# Altium project BARBAROV Power Distrubution Board.PrjPcb
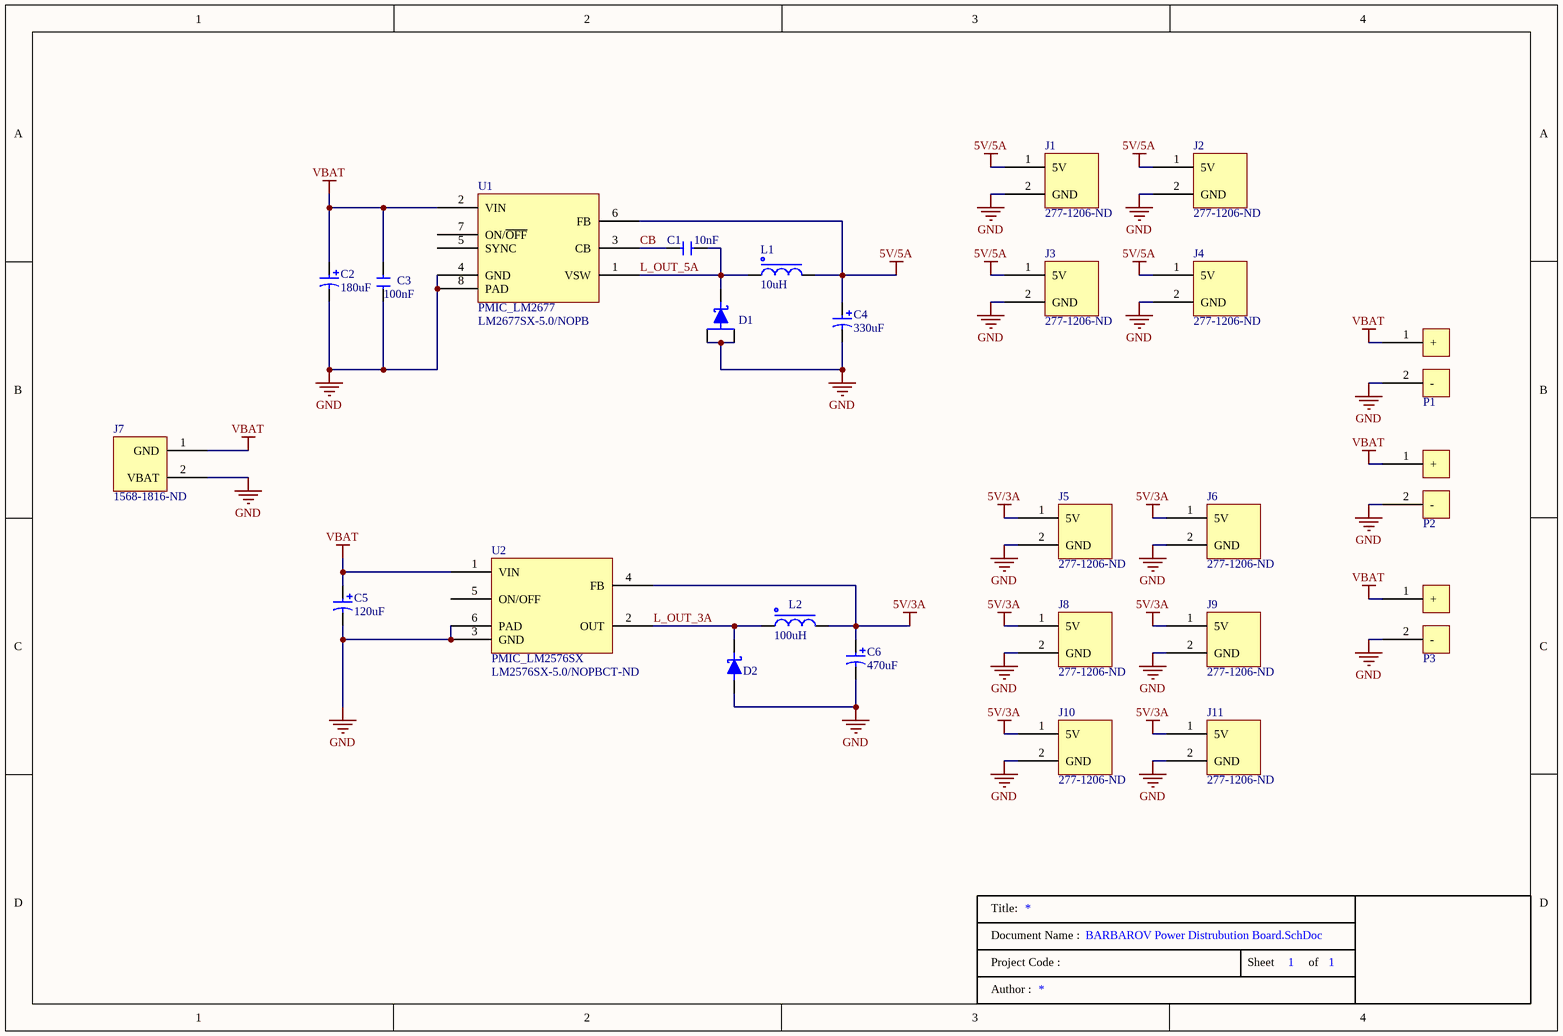
[diagram p0: BARBAROV Power Distrubution Board.SchDoc]
1 sheet, 26 parts. Net scope: global (net labels, ports and power ports of the same name join across sheets).
Board file: BARBAROV Power Distrubution Board PCB.PcbDoc

## Sheet BARBAROV Power Distrubution Board.SchDoc
size A4; SheetNumber: 1; SheetTotal: 1

### Parts
C1  Capacitance: 10nF  [0805_CAP]  (hidden comment: CAP_10nF_%10_50V_0805_X7R_CER)
C2  Capacitance: 180uF  [RADIAL-2_8.30MMX8.30MM_PANASONIC]  (hidden comment: CAP_180uF_20%_25V_SMD_ALUM POLY_8.30mmx8.30mm)
C3  Capacitance: 100nF  [0805_CAP]  (hidden comment: CAP_100nF_50V_0805_C0G_CER)
C4  Capacitance: 330uF  [RADIAL-2_8.30MMX8.30MM_PANASONIC]  (hidden comment: CAP_330uF_20%_16V_SMD_ALUM POLY_8.30mm x 8.30mm)
C5  Capacitance: 120uF  [CAP_6SVPC330M]  (hidden comment: CAP_120uF_20%_20V_ALUM POLY_SMD)
C6  Capacitance: 470uF  [CAP_EEVTG1C471Q]  (hidden comment: CAP_470uF_20%_16V_SMD_ALUM)
D1  DIODE_SCHOTTKY_200V_10A_DPAK  [3PIN_DPAK_DIODE]  (value not drawn)
D2  DIODE_SCHOTTKY_20V_4A_DO214AB  [DIOM6959X25M]  (value not drawn)
J1  Supplier Part Number 1: 277-1206-ND  [CONN TERM BLOCK HDR 2POS 90DEG 3.81MM]  (hidden comment: CONN_TERM BLOCK_HDR_2POS_VERT_3.81MM)
J2  Supplier Part Number 1: 277-1206-ND  [CONN TERM BLOCK HDR 2POS 90DEG 3.81MM]  (hidden comment: CONN_TERM BLOCK_HDR_2POS_VERT_3.81MM)
J3  Supplier Part Number 1: 277-1206-ND  [CONN TERM BLOCK HDR 2POS 90DEG 3.81MM]  (hidden comment: CONN_TERM BLOCK_HDR_2POS_VERT_3.81MM)
J4  Supplier Part Number 1: 277-1206-ND  [CONN TERM BLOCK HDR 2POS 90DEG 3.81MM]  (hidden comment: CONN_TERM BLOCK_HDR_2POS_VERT_3.81MM)
J5  Supplier Part Number 1: 277-1206-ND  [CONN TERM BLOCK HDR 2POS 90DEG 3.81MM]  (hidden comment: CONN_TERM BLOCK_HDR_2POS_VERT_3.81MM)
J6  Supplier Part Number 1: 277-1206-ND  [CONN TERM BLOCK HDR 2POS 90DEG 3.81MM]  (hidden comment: CONN_TERM BLOCK_HDR_2POS_VERT_3.81MM)
J7  Supplier Part Number 1: 1568-1816-ND  [XT60_CONN]  (hidden comment: CONN_XT60)
J8  Supplier Part Number 1: 277-1206-ND  [CONN TERM BLOCK HDR 2POS 90DEG 3.81MM]  (hidden comment: CONN_TERM BLOCK_HDR_2POS_VERT_3.81MM)
J9  Supplier Part Number 1: 277-1206-ND  [CONN TERM BLOCK HDR 2POS 90DEG 3.81MM]  (hidden comment: CONN_TERM BLOCK_HDR_2POS_VERT_3.81MM)
J10  Supplier Part Number 1: 277-1206-ND  [CONN TERM BLOCK HDR 2POS 90DEG 3.81MM]  (hidden comment: CONN_TERM BLOCK_HDR_2POS_VERT_3.81MM)
J11  Supplier Part Number 1: 277-1206-ND  [CONN TERM BLOCK HDR 2POS 90DEG 3.81MM]  (hidden comment: CONN_TERM BLOCK_HDR_2POS_VERT_3.81MM)
L1  Inductance: 10uH  [IND13.70MM13.70MMX7MM]  (hidden comment: IND_10uH_10A_16.8MOHM_SMD)
L2  Inductance: 100uH  [SMD_IND_22.48MMX22.00MM]  (hidden comment: IND_100uH_9.1A_39.4MOHM_SM)
P1  ESC_PAD  [ESC_SOLDER_PAD]  (value not drawn)  (no BOM)
P2  ESC_PAD  [ESC_SOLDER_PAD]  (value not drawn)  (no BOM)
P3  ESC_PAD  [ESC_SOLDER_PAD]  (value not drawn)  (no BOM)
U1  PMIC_LM2677  Manufacturer Part Number: LM2677SX-5.0/NOPB  [DPAK127P1435X464-8M]
U2  PMIC_LM2576SX  Supplier Part Number 1: LM2576SX-5.0/NOPBCT-ND  [TO-263-6/DDPAK]

### Nets
5V/3A: C6.1 J5.1(5V) J6.1(5V) J8.1(5V) J9.1(5V) J10.1(5V) J11.1(5V) L2.2 U2.4(FB)
5V/5A: C4.1 J1.1(5V) J2.1(5V) J3.1(5V) J4.1(5V) L1.2 U1.6(FB)
GND: C2.2 C3.2 C4.2 C5.2 C6.2 D1.1(ANODE) D1.3(ANODE) D2.1(ANODE) J1.2(GND) J2.2(GND) J3.2(GND) J4.2(GND) J5.2(GND) J6.2(GND) J7.2(VBAT) J8.2(GND) J9.2(GND) J10.2(GND) J11.2(GND) P1.2(-) P2.2(-) P3.2(-) U1.4(GND) U1.8(PAD) U2.3(GND) U2.6(PAD)
VBAT: C2.1 C3.1 C5.1 J7.1(GND) P1.1(+) P2.1(+) P3.1(+) U1.2(VIN) U2.1(VIN)
CB: C1.1 U1.3(CB)
L_OUT_3A: D2.2(CATHODE) L2.1 U2.2(OUT)
L_OUT_5A: C1.2 D1.2(CATHODE) L1.1 U1.1(VSW)

Not connected (* = marked no-connect by the designer): U1 5(SYNC) 7(ON/~{OFF}); U2 5(ON/OFF)

### Notes on the sheet
- Title:
- Document Name :
- Project Code :
- Sheet
- of
- Author :

### Library data of the parts
C1 = CAP_10nF_%10_50V_0805_X7R_CER: CAP CER 10000PF 50V X7R 0805; Manufacturer: Samsung; Manufacturer Part Number: CL21B103KBANNNC; Material: Ceramic; Tolerance: 10%; Supplier 1: Digi-Key; RoHS: Yes; Category: Ceramic Capacitors; Stock 1: 1431273; Pricing 1: 1=0,10000, 10=0,04600, 50=0,02500, 100=0,02050, 500=0,01464, 1000=0,01150 (USD); Mount: Surface Mount; Case/Package: 0805; Case Code (Metric): 2012; Case Code (Imperial): 0805; Contact Plating: Tin; Min Operating Temperature: -55°C; Max Operating Temperature: 125°C; Dielectric: X7R; Voltage: 50V; Voltage Rating (DC): 50V; Packaging: Tape and Reel; Voltage Rating: 50V; Series: CL; Construction: Flat; Length: 2mm; Width: 0.049inch; Height: 0.65mm; Depth: 1.25mm; Thickness: 0.03inch; Radiation Hardening: No; Lead Free: Lead Free; RoHS Compliant: Yes; ComponentLink1URL: https://datasheet.ciiva.com/25709/cl21b103kbannnc-25709781.pdf?src-supplier=Digi-Key; ComponentLink1Description: https://datasheet.ciiva.com/25709/cl21b103kbannnc-25709781.pdf?src-supplier=Digi-Key; ComponentLink2URL: https://datasheet.ciiva.com/29199/455082-da-01-en-vs-kondensator-0805-29199459.pdf?src-supplier=Conrad; ComponentLink2Description: https://datasheet.ciiva.com/29199/455082-da-01-en-vs-kondensator-0805-29199459.pdf?src-supplier=Conrad; Supplier Part Number 1: 1276-1015-1-ND
C2 = CAP_180uF_20%_25V_SMD_ALUM POLY_8.30mmx8.30mm: Cap Aluminum Polymer 180uF 25V 20% Cylindrical 16m Ohm 1470mA 2000 hr 125°C Emboss T/R; Manufacturer: Panasonic; Manufacturer Part Number: 25SVT180M; Supplier 1: Digi-Key; RoHS: Yes; Category: Polymer Capacitors; Stock 1: 129; Pricing 1: 1=3,01000, 10=2,43800, 50=2,12720, 100=1,86140 (USD); Supplier Part Number 1: 10-25SVT180MCT-ND
C3 = CAP_100nF_50V_0805_C0G_CER: Cap Ceramic 0.1uF 50V X7R 20% SMD 0805 125C Paper T/R; Manufacturer: KEMET; Manufacturer Part Number: C0805C104M5RACTU; Supplier 1: Digi-Key; RoHS: Yes; Category: Ceramic Capacitors; Stock 1: 4863; Pricing 1: 1=0,10000, 10=0,06400, 50=0,03500, 100=0,02860, 500=0,02040, 1000=0,01603 (USD); Mount: Surface Mount; Case/Package: 0805; Dielectric Material: Ceramic; Min Operating Temperature: -55°C; Max Operating Temperature: 125°C; Tolerance: 20%; Packaging: Tape and Reel; Dielectric: X7R; Voltage Rating (DC): 50V; Length: 2mm; Height: 0.9mm; Depth: 1.25mm; Radiation Hardening: No; ComponentLink1URL: http://uk.rs-online.com/webdocs/13da/0900766b813daa06.pdf?src-supplier=RSComponents; ComponentLink1Description: http://uk.rs-online.com/webdocs/13da/0900766b813daa06.pdf?src-supplier=RSComponents; ComponentLink2URL: http://uk.rs-online.com/webdocs/1515/0900766b81515223.pdf?src-supplier=RSComponents; ComponentLink2Description: http://uk.rs-online.com/webdocs/1515/0900766b81515223.pdf?src-supplier=RSComponents; ComponentLink3URL: http://www.farnell.com/datasheets/2739857.pdf?src-supplier=Farnell; ComponentLink3Description: http://www.farnell.com/datasheets/2739857.pdf?src-supplier=Farnell; ComponentLink4URL: http://components.arrow.com/part/dataview/0323_00324812?src-supplier=Arrow+Europe; ComponentLink4Description: http://components.arrow.com/part/dataview/0323_00324812?src-supplier=Arrow+Europe; ComponentLink5URL: http://uk.rs-online.com/webdocs/1528/0900766b81528e2f.pdf?src-supplier=RSComponents; ComponentLink5Description: http://uk.rs-online.com/webdocs/1528/0900766b81528e2f.pdf?src-supplier=RSComponents; ComponentLink6URL: http://www.farnell.com/datasheets/2739857.pdf?src-supplier=Newark; ComponentLink6Description: http://www.farnell.com/datasheets/2739857.pdf?src-supplier=Newark; ComponentLink7URL: https://api.kemet.com/component-edge/download/datasheet/C0805C104M5RACTU.pdf?src-supplier=Digi-Key; ComponentLink7Description: https://api.kemet.com/component-edge/download/datasheet/C0805C104M5RACTU.pdf?src-supplier=Digi-Key; ComponentLink8URL: http://www.farnell.com/datasheets/2739857.pdf?src-supplier=Element14; ComponentLink8Description: http://www.farnell.com/datasheets/2739857.pdf?src-supplier=Element14; ComponentLink9URL: http://www.alliedelec.com/m/d/9bfe7773041ffe9d406e68bc7b377fdd.pdf?src-supplier=Allied+Electronics; ComponentLink9Description: http://www.alliedelec.com/m/d/9bfe7773041ffe9d406e68bc7b377fdd.pdf?src-supplier=Allied+Electronics; ComponentLink10URL: http://www.mouser.com/ds/2/212/KEM_C1002_X7R_SMD-1102033.pdf?src-supplier=Mouser; ComponentLink10Description: http://www.mouser.com/ds/2/212/KEM_C1002_X7R_SMD-1102033.pdf?src-supplier=Mouser; ComponentLink11URL: http://capacitoredge.kemet.com/capedge2/DataSheet?pn=C0805C104M5RACTU&src-supplier=Avnet+Europe; ComponentLink11Description: http://capacitoredge.kemet.com/capedge2/DataSheet?pn=C0805C104M5RACTU&src-supplier=Avnet+Europe; Supplier Part Number 1: 399-C0805C104M5RAC7800CT-ND
C4 = CAP_330uF_20%_16V_SMD_ALUM POLY_8.30mm x 8.30mm: Cap Alum Poly 330UF 20% 16V SMD; Manufacturer: Wurth Electronics; Manufacturer Part Number: 875075355004; ESR (Equivalent Series Resistance): 10mR; Polarity: Polar; Ripple Current: 4.7A; Life (Hours): 2000Hour; Supplier 1: Digi-Key; RoHS: Yes; Category: Polymer Capacitors; Stock 1: 2224; Pricing 1: 1=1,18000, 50=1,00600, 100=0,87700 (USD); Mount: Surface Mount; Case/Package: Radial; Min Operating Temperature: -55°C; Max Operating Temperature: 105°C; Package Quantity: 400; Packaging: Tape and Reel; Voltage Rating: 16V; Tolerance: 20%; Voltage Rating (DC): 16V; Height - Seated (Max): 0.461inch; REACH SVHC: Unknown; RoHS Compliant: Yes; ComponentLink1URL: http://www.farnell.com/datasheets/1880458.pdf?src-supplier=Farnell; ComponentLink1Description: http://www.farnell.com/datasheets/1880458.pdf?src-supplier=Farnell; ComponentLink2URL: http://katalog.we-online.de/pbs/datasheet/875075355004.pdf?src-supplier=Digi-Key; ComponentLink2Description: http://katalog.we-online.de/pbs/datasheet/875075355004.pdf?src-supplier=Digi-Key; ComponentLink3URL: http://www.farnell.com/datasheets/1880458.pdf?src-supplier=Element14; ComponentLink3Description: http://www.farnell.com/datasheets/1880458.pdf?src-supplier=Element14; Supplier Part Number 1: 732-6491-1-ND
C5 = CAP_120uF_20%_20V_ALUM POLY_SMD: Cap Aluminum Polymer 120uF 20VDC 20%( 6.3 X 5.9mm) SMD 0.025 Ohm 3200mA 5000h 105C T/R; Manufacturer: Panasonic; Manufacturer Part Number: 20SVPF120M; Voltage Rating: 20V; ESR (Equivalent Series Resistance): 25mR; Ripple Current: 3.2A; Leakage Current: 480uA; Polarity: Polar; Life (Hours): 5000Hour; Dissipation Factor: 12%; Supplier 1: Digi-Key; RoHS: Yes; Category: Aluminum Electrolytic Capacitors; Stock 1: 5; Pricing 1: 1=1,41000, 10=1,11000, 50=0,96240, 100=0,83280, 500=0,62922 (USD); Mount: Surface Mount; Case/Package: Radial; Number of Pins: 6; Material: Polymer; Min Operating Temperature: -55°C; Max Operating Temperature: 105°C; Tolerance: 20%; Packaging: Tape and Reel; Voltage Rating (DC): 20V; Package Quantity: 1000; Ripple Current (AC): 3.2A; Termination: SMD/SMT; Voltage: 20V; Diameter: 6.3mm; Length: 5.9mm; Height: 5.9mm; Height - Seated (Max): 0.236inch; Radiation Hardening: No; REACH SVHC: No SVHC; Lead Free: Lead Free; RoHS Compliant: Yes; ComponentLink1URL: https://datasheet.ciiva.com/24432/svpf-series-datasheet-24432811.pdf?src-supplier=Onlinecomponents.com; ComponentLink1Description: https://datasheet.ciiva.com/24432/svpf-series-datasheet-24432811.pdf?src-supplier=Onlinecomponents.com; ComponentLink2URL: https://datasheet.ciiva.com/25746/1734360-25746680.pdf?src-supplier=Farnell; ComponentLink2Description: https://datasheet.ciiva.com/25746/1734360-25746680.pdf?src-supplier=Farnell; ComponentLink3URL: https://datasheet.ciiva.com/22746/1734360-22746206.pdf?src-supplier=Element14; ComponentLink3Description: https://datasheet.ciiva.com/22746/1734360-22746206.pdf?src-supplier=Element14; ComponentLink4URL: https://datasheet.ciiva.com/46650/70324301-46650876.pdf?src-supplier=Allied+Electronics; ComponentLink4Description: https://datasheet.ciiva.com/46650/70324301-46650876.pdf?src-supplier=Allied+Electronics; Supplier Part Number 1: P16498CT-ND
C6 = CAP_470uF_20%_16V_SMD_ALUM: 贴片铝电解电容 470uF ±20% 16V 0.12Ω 2000hrs@125°C AEC_D12.5x13.5mm_SM; Manufacturer: Panasonic; Manufacturer Part Number: EEV-TG1C471Q; ESR (Equivalent Series Resistance): 120mR; Ripple Current: 800mA; Polarity: Polar; Life (Hours): 2000Hour; Dissipation Factor: 0.23%; Supplier 1: Digi-Key; RoHS: Yes; Category: Aluminum Electrolytic Capacitors; Stock 1: 6175; Pricing 1: 1=1,92000, 10=1,51400, 50=1,31240, 100=1,13570 (USD); Mount: Surface Mount,PCB; Case/Package: Radial; Min Operating Temperature: -40°C; Max Operating Temperature: 125°C; Tolerance: 20%; Voltage Rating (DC): 16V; Packaging: Tape and Reel; Voltage Rating: 16V; Package Quantity: 200; Ripple Current (AC): 800mA; Termination: SMD/SMT; Series: TG; Construction: Cylindrical; Diameter: 12.5mm; Length: 13.5mm; Width: 900um; Height: 13.5mm; Height - Seated (Max): 0.531inch; Radiation Hardening: No; REACH SVHC: No SVHC; Lead Free: Lead Free; RoHS Compliant: Yes; ComponentLink1URL: https://datasheet.ciiva.com/8081/aba0000ce101-8081367.pdf?src-supplier=Element14; ComponentLink1Description: https://datasheet.ciiva.com/8081/aba0000ce101-8081367.pdf?src-supplier=Element14; ComponentLink2URL: https://datasheet.ciiva.com/43470/1678958-43470874.pdf?src-supplier=Farnell; ComponentLink2Description: https://datasheet.ciiva.com/43470/1678958-43470874.pdf?src-supplier=Farnell; ComponentLink3URL: https://datasheet.ciiva.com/46379/1678958-46379244.pdf?src-supplier=Element14; ComponentLink3Description: https://datasheet.ciiva.com/46379/1678958-46379244.pdf?src-supplier=Element14; ComponentLink4URL: https://datasheet.ciiva.com/31417/1678958-31417838.pdf?src-supplier=Farnell; ComponentLink4Description: https://datasheet.ciiva.com/31417/1678958-31417838.pdf?src-supplier=Farnell; ComponentLink5URL: https://datasheet.ciiva.com/46372/1678958-46372616.pdf?src-supplier=Element14; ComponentLink5Description: https://datasheet.ciiva.com/46372/1678958-46372616.pdf?src-supplier=Element14; ComponentLink6URL: https://datasheet.ciiva.com/24025/aba0000ce101-30808-24025129.pdf?src-supplier=Mouser; ComponentLink6Description: https://datasheet.ciiva.com/24025/aba0000ce101-30808-24025129.pdf?src-supplier=Mouser; ComponentLink7URL: https://datasheet.ciiva.com/14598/70068299-14598696.pdf?src-supplier=Allied+Electronics; ComponentLink7Description: https://datasheet.ciiva.com/14598/70068299-14598696.pdf?src-supplier=Allied+Electronics; ComponentLink8URL: https://datasheet.ciiva.com/11679/aba0000ce101-11679349.pdf?src-supplier=Avnet; ComponentLink8Description: https://datasheet.ciiva.com/11679/aba0000ce101-11679349.pdf?src-supplier=Avnet; ComponentLink9URL: https://datasheet.ciiva.com/30085/aba0000ce101-30085800.pdf?src-supplier=Onlinecomponents.com; ComponentLink9Description: https://datasheet.ciiva.com/30085/aba0000ce101-30085800.pdf?src-supplier=Onlinecomponents.com; Supplier Part Number 1: PCE3629CT-ND
D1 = DIODE_SCHOTTKY_200V_10A_DPAK: Diode Schottky 200V 10A Dpak; Manufacturer: Sangdest Microelectronics; Manufacturer Part Number: SBRD10200; Supplier 1: Digi-Key; RoHS: No; Category: Uncategorized; Stock 1: 138862; Pricing 1: 1=0,59000, 10=0,50300, 100=0,37580, 500=0,29524, 1000=0,22814 (USD); Supplier Part Number 1: 1655-SBRD10200CT-ND
D2 = DIODE SCHOTTKY 20V 4A DO214AB: SL42 Series 20 V 2 A Surface Mount Schottky Barrier Rectifier - DO-214AB (SMC); Manufacturer: Vishay Semiconductors; Manufacturer Part Number: SL42-E3/57T; Forward Voltage: 470mV; Max Reverse Current: 500uA; Max Surge Current: 150A; Forward Current: 4A; Max Repetitive Reverse Voltage (Vrrm): 20V; Element Configuration: Single; Polarity: Standard; Supplier 1: Digi-Key; RoHS: Yes; Category: Rectifier Diodes; Stock 1: 210; Pricing 1: 1=0,97000, 10=0,87000, 100=0,67830 (USD); Mount: Surface Mount; Case/Package: SMC; Number of Pins: 2; Min Operating Temperature: -55°C; Max Operating Temperature: 125°C; Packaging: Tape and Reel; Package Quantity: 1; Max Reverse Leakage Current: 500uA; Average Rectified Current: 4A; Peak Non-Repetitive Surge Current: 150A; Max Forward Surge Current (Ifsm): 150A; Voltage Rating (DC): 20V; Current Rating: 4A; Output Current: 4A; Max Reverse Voltage (DC): 20V; Series: -; Radiation Hardening: No; REACH SVHC: Unknown; Lead Free: Lead Free; RoHS Compliant: Yes; ComponentLink1URL: https://datasheet.ciiva.com/4714/88742-103296-4714672.pdf?src-supplier=Mouser; ComponentLink1Description: https://datasheet.ciiva.com/4714/88742-103296-4714672.pdf?src-supplier=Mouser; ComponentLink2URL: https://datasheet.ciiva.com/16355/sl42-16355184.pdf?src-supplier=Future+Electronics; ComponentLink2Description: https://datasheet.ciiva.com/16355/sl42-16355184.pdf?src-supplier=Future+Electronics; ComponentLink3URL: https://datasheet.ciiva.com/23793/1691224-23793280.pdf?src-supplier=Newark; ComponentLink3Description: https://datasheet.ciiva.com/23793/1691224-23793280.pdf?src-supplier=Newark; ComponentLink4URL: https://datasheet.ciiva.com/4246/sl42-4246044.pdf?src-supplier=Arrow+Electronics; ComponentLink4Description: https://datasheet.ciiva.com/4246/sl42-4246044.pdf?src-supplier=Arrow+Electronics; Supplier Part Number 1: SL42-E3/57TGICT-ND
J1-J6 J8-J11 = CONN_TERM BLOCK_HDR_2POS_VERT_3.81MM: 2 Position Terminal Block Header, Male Pins, Shrouded (4 Side) 0.150" (3.81mm) 90°, Right Angle - Through Hole; Manufacturer: Phoenix Contact; Manufacturer Part Number: 1803277; Max Current Rating: 8A; Number of Contacts: 2; Voltage Rating: 160V; Number of Levels: 1; Voltage: 300V; Connector Type: Plug,PCB,Terminal Block; Voltage Rating (DC): 640mV; Approvals: UL,CSA; Supplier 1: Digi-Key; RoHS: Yes; Category: Terminal Blocks; Stock 1: 18415; Pricing 1: 1=0,91000, 10=0,87400, 50=0,83600, 100=0,81320, 250=0,76000, 500=0,69920, 1000=0,64600, 2500=0,61560, 5000=0,58520 (USD); Mount: Through Hole; Contact Plating: Tin; Housing Color: Green; Housing Material: Polybutylene; Contact Material: Tin; Color: Green; Weight: 4oz; Number of Rows: 1; Packaging: Bulk; Termination: Solder; Orientation: Right Angle; Gender: Male; Package Quantity: 50; Number of Poles: 2; Current Rating: 8A; Number of Positions Per Level: 2; Current: 8A; Number of Positions: 2; Series: MC; Voltage Rating (AC): 160V; Contact Gender: Male; Length: 9.01mm; Width: 10.65mm; Height: 9.2mm; Pitch: 3.81mm; Depth: 9.2mm; Lead Free: Lead Free; RoHS Compliant: Yes; REACH SVHC: Unknown; Flammability Rating: UL94 V-0; ComponentLink1URL: https://datasheet.ciiva.com/16096/1803277-16096845.pdf?src-supplier=Onlinecomponents.com; ComponentLink1Description: https://datasheet.ciiva.com/16096/1803277-16096845.pdf?src-supplier=Onlinecomponents.com; ComponentLink2URL: https://datasheet.ciiva.com/26840/getdatasheetpartid-233794-26840495.pdf?src-supplier=Verical; ComponentLink2Description: https://datasheet.ciiva.com/26840/getdatasheetpartid-233794-26840495.pdf?src-supplier=Verical; ComponentLink3URL: https://datasheet.ciiva.com/11746/0900766b80029ea6-11746612.pdf?src-supplier=RSComponents; ComponentLink3Description: https://datasheet.ciiva.com/11746/0900766b80029ea6-11746612.pdf?src-supplier=RSComponents; ComponentLink4URL: https://datasheet.ciiva.com/795/1803277-795413.pdf?src-supplier=Digi-Key; ComponentLink4Description: https://datasheet.ciiva.com/795/1803277-795413.pdf?src-supplier=Digi-Key; ComponentLink5URL: https://datasheet.ciiva.com/23596/1581611-23596276.pdf?src-supplier=Newark; ComponentLink5Description: https://datasheet.ciiva.com/23596/1581611-23596276.pdf?src-supplier=Newark; ComponentLink6URL: https://datasheet.ciiva.com/29212/740533-da-01-de-leiterplattenstecker-mc-1-5-2-g-3-81-29212066.pdf?src-supplier=Conrad; ComponentLink6Description: https://datasheet.ciiva.com/29212/740533-da-01-de-leiterplattenstecker-mc-1-5-2-g-3-81-29212066.pdf?src-supplier=Conrad
J7 = CONN_XT60: XT60 Connectors Male/female Pair; Manufacturer: SparkFun; Manufacturer Part Number: PRT-10474; Supplier 1: Digi-Key; RoHS: No; Stock 1: 2196; Pricing 1: 1=1,50000 (USD); ComponentLink1URL: https://cdn.sparkfun.com/datasheets/Prototyping/xt60.pdf?src-supplier=Digi-Key; ComponentLink1Description: https://cdn.sparkfun.com/datasheets/Prototyping/xt60.pdf?src-supplier=Digi-Key
L1 = IND_10uH_10A_16.8MOHM_SMD: Inductor Power Shielded Wirewound 10uH 20% 100KHz Iron 10A 0.0168Ohm DCR T/R; Manufacturer: Bourns; Manufacturer Part Number: SRP1270-100M; Core Material: Ferrite; Self Resonant Frequency: 10MHz; Saturation Current: 16A; DC Resistance (DCR): 16.8mR; Current: 15A; Supplier 1: Digi-Key; RoHS: Yes; Category: Fixed Inductors; Stock 1: 10712; Pricing 1: 1=1,83000, 10=1,69100, 25=1,54960, 50=1,32420, 100=1,18340 (USD); Mount: Surface Mount; Case/Package: Nonstandard; Min Operating Temperature: -55°C; Max Operating Temperature: 125°C; Packaging: Tape and Reel; Package Quantity: 400; Termination: SMD/SMT; Tolerance: 20%; Shielding: Shielded; Current Rating: 10A; Inductance Tolerance: 20%; Resistor Type: Wirewound; Test Frequency: 100kHz; Max DC Current: 10A; DC Current: 10A; RMS Current (Irms): 10A; Series: SRP1270; Length: 13.7mm; Width: 0.539inch; Height: 7mm; Height - Seated (Max): 0.276inch; Depth: 13.7mm; Radiation Hardening: No; REACH SVHC: No SVHC; Military Standard: Not; RoHS Compliant: Yes; ComponentLink1URL: https://datasheet.ciiva.com/22704/1834359-22704150.pdf?src-supplier=Element14; ComponentLink1Description: https://datasheet.ciiva.com/22704/1834359-22704150.pdf?src-supplier=Element14; ComponentLink2URL: https://datasheet.ciiva.com/11802/0900766b80f2b679-11802877.pdf?src-supplier=RSComponents; ComponentLink2Description: https://datasheet.ciiva.com/11802/0900766b80f2b679-11802877.pdf?src-supplier=RSComponents; ComponentLink3URL: https://datasheet.ciiva.com/3082/srp1270-3082275.pdf?src-supplier=Avnet; ComponentLink3Description: https://datasheet.ciiva.com/3082/srp1270-3082275.pdf?src-supplier=Avnet; ComponentLink4URL: https://datasheet.ciiva.com/6698/srp1270-6698645.pdf?src-supplier=Digi-Key; ComponentLink4Description: https://datasheet.ciiva.com/6698/srp1270-6698645.pdf?src-supplier=Digi-Key; ComponentLink5URL: https://datasheet.ciiva.com/6698/srp1270-6698646.pdf?src-supplier=Digi-Key; ComponentLink5Description: https://datasheet.ciiva.com/6698/srp1270-6698646.pdf?src-supplier=Digi-Key; ComponentLink6URL: https://datasheet.ciiva.com/15160/getdatasheetpartid-137626-15160492.pdf?src-supplier=Verical; ComponentLink6Description: https://datasheet.ciiva.com/15160/getdatasheetpartid-137626-15160492.pdf?src-supplier=Verical; ComponentLink7URL: https://datasheet.ciiva.com/17286/srp1270-17286206.pdf?src-supplier=Avnet+Europe; ComponentLink7Description: https://datasheet.ciiva.com/17286/srp1270-17286206.pdf?src-supplier=Avnet+Europe; Supplier Part Number 1: SRP1270-100MCT-ND
L2 = IND_100uH_9.1A_39.4MOHM_SM: Inductor Power Shielded Wirewound 100uH 20% 100KHz Powdered Iron 9.1A 0.0394Ohm DCR 8787 T/R; Manufacturer: Vishay Dale; Manufacturer Part Number: IHLP8787MZER101M51; DC Resistance (DCR): 39.4mR; Supplier 1: Digi-Key; RoHS: Yes; Category: Inductors; Stock 1: 27; Pricing 1: 1=10,02000, 10=8,91000, 25=8,24160, 50=7,12800 (USD); Case/Package: 8787; Min Operating Temperature: -55°C; Max Operating Temperature: 155°C; Shielding: Shielded; Termination: SMD/SMT; Packaging: Tape and Reel; Tolerance: 20%; Max DC Current: 9.1A; Package Quantity: 100; Length: 22mm; Width: 22.48mm; Height: 13mm; RoHS Compliant: Yes; ComponentLink1URL: http://www.mouser.com/ds/2/427/ihlp8787mz51-537150.pdf?src-supplier=Mouser; ComponentLink1Description: http://www.mouser.com/ds/2/427/ihlp8787mz51-537150.pdf?src-supplier=Mouser; Supplier Part Number 1: 541-IHLP8787MZER101M51CT-ND
U1 = PMIC_LM2677: SIMPLE SWITCHE High Efficiency 5A Step-Down Voltage egulator with Sync 7-DDPAK/TO-263 -40 to 125; Manufacturer: TI National Semiconductor; Max Input Voltage: 40V; Output Voltage: 5V; Min Input Voltage: 8V; Number of Outputs: 1; Efficiency: 84%; Switching Frequency: 260kHz; Synchronous Rectifier: No; Quiescent Current: 4.2mA; Output Type: Fixed; Output Configuration: Positive; Supplier 1: Digi-Key; RoHS: Yes; Category: Voltage Regulators - Switching; Stock 1: 763; Pricing 1: 1=6,95000, 10=6,24400, 25=5,90280, 100=5,11580, 250=4,85348 (USD); Mount: Surface Mount; Case/Package: TO-263; Contact Plating: Tin,Matte; Min Operating Temperature: -40°C; Max Operating Temperature: 125°C; Output Current: 5A; Packaging: Tape and Reel; Package Quantity: 500; Max Output Current: 5A; Min Output Voltage: 5V; Operating Supply Voltage: 40V; Radiation Hardening: No; Lead Free: Contains Lead; RoHS Compliant: Yes; ComponentLink1URL: https://datasheet.ciiva.com/15112/getdatasheetpartid-55533-15112619.pdf?src-supplier=Verical; ComponentLink1Description: https://datasheet.ciiva.com/15112/getdatasheetpartid-55533-15112619.pdf?src-supplier=Verical; ComponentLink2URL: https://datasheet.ciiva.com/26100/lm2677-26100074.pdf?src-supplier=Avnet+Europe; ComponentLink2Description: https://datasheet.ciiva.com/26100/lm2677-26100074.pdf?src-supplier=Avnet+Europe; ComponentLink3URL: https://datasheet.ciiva.com/14304/lm2677-14304284.pdf?src-supplier=Avnet; ComponentLink3Description: https://datasheet.ciiva.com/14304/lm2677-14304284.pdf?src-supplier=Avnet; Supplier Part Number 1: 296-48568-1-ND
U2 = PMIC_LM2576SX: IC REG BUCK 5V 3A TO263-5; Manufacturer: TI National Semiconductor; Manufacturer Part Number: LM2576SX-5.0/NOPB; Number of Outputs: 1; Min Input Voltage: 4V; Max Input Voltage: 40V; Switching Frequency: 52kHz; Efficiency: 77%; Synchronous Rectifier: No; Quiescent Current: 5mA; Output Type: Fixed; Supplier 1: Digi-Key; RoHS: Yes; Category: Voltage Regulators - Switching; Stock 1: 2560; Pricing 1: 1=4,06000, 10=3,64300, 25=3,44400, 100=2,98470, 250=2,83168 (USD); Mount: Surface Mount; Case/Package: TO-263-6; Number of Pins: 5; Contact Plating: Tin; Min Operating Temperature: -40°C; Max Operating Temperature: 125°C; Output Voltage: 5V; Max Output Current: 3A; Operating Supply Voltage: 40V; Packaging: Tape and Reel; Output Current: 3A; Package Quantity: 500; Series: SIMPLE SWITCHER®; Nominal Output Voltage: 5V; Radiation Hardening: No; REACH SVHC: No SVHC; Lead Free: Contains Lead; RoHS Compliant: Yes; ComponentLink1URL: https://datasheet.ciiva.com/41457/001013741-da-01-en-ic-reg-bu-lm2576sx-5-0-nopb-to-263-5-tid-41457614.pdf?src-supplier=Conrad; ComponentLink1Description: https://datasheet.ciiva.com/41457/001013741-da-01-en-ic-reg-bu-lm2576sx-5-0-nopb-to-263-5-tid-41457614.pdf?src-supplier=Conrad